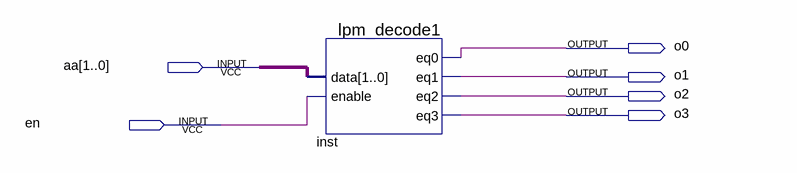
[diagram p0: schematic sheet]
// Quartus schematic test.bdf as structural Verilog: 1 symbols, 6 pins
module test (
  input  [1:0] aa,
  input  en,
  output o0,
  output o1,
  output o2,
  output o3
);

  lpm_decode1 inst (.data(aa), .enable(en), .eq0(o0), .eq1(o1), .eq2(o2), .eq3(o3));
endmodule
